# Altium schematic sheet power_supply.SchDoc
size A; PageSetup: Record=PageOptions|CenterHorizontal=True|CenterVertical=True|PrintScale=1.00|XCorrection=1.00|YCorrection=1.00|PrintKind=1|BorderSize=5000000|LeftOffset=0|BottomOffset=0|Orientation=2|PaperLength=1000|PaperWidth=1000|Scale=100|PaperSource=7|PrintQuality=-4|MediaType=1|DitherType=10|PaperKind=A4|PrintScaleMode=1
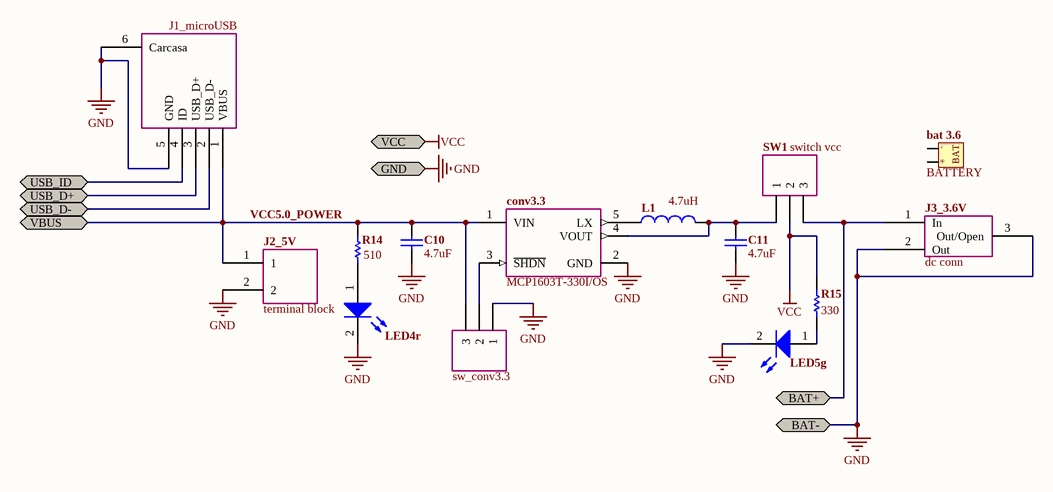
[diagram p0: power_supply.SchDoc]

## Parts
bat_3.6  BATTERY  [BATTERY HOLDER 3 cells]
C10  value 4.7uF  [1608[0603]]  (hidden comment: Cap)
C11  value 4.7uF  [1608[0603]]  (hidden comment: Cap)
conv3.3  MCP1603T-330I/OS  [TSOT-OS5_N]
J1_microUSB  J1_microUSB  [microUSB AB]
J2_5V  terminal block  [Conector ED-1631]
J3_3.6V  dc conn  [DC Connector]
L1  value 4.7uH  [CD3225-1210]  (hidden comment: L)
LED4r  LED_SMD_Hg  [1608[0603]]  (value not drawn)
LED5g  LED_SMD_Hg  [1608[0603]]  (value not drawn)
R14  value 510  [1608[0603]]  (hidden comment: Res1)
R15  value 330  [1608[0603]]  (hidden comment: R)
SW1  switch vcc  [SWITCH-2]
SW2  sw_conv3.3  [HDR1X3]

## Ports
BAT+, BAT-, GND, USB_D+, USB_D-, USB_ID, VBUS, VCC

## Nets
GND: C10.1 C11.1 conv3.3.2(GND) J1_microUSB.5(GND) J1_microUSB.6(Carcasa) J2_5V.2 J3_3.6V.2(Out) J3_3.6V.3(Out/Open) LED4r.2(K) LED5g.2(K) SW2.1 ; port BAT-, port GND
VCC: R15.2 SW1.2 ; port VCC
BAT+: J3_3.6V.1(In) SW1.3 ; port BAT+
USB_D+: J1_microUSB.3(USB_D+) ; port USB_D+
USB_D-: J1_microUSB.2(USB_D-) ; port USB_D-
USB_ID: J1_microUSB.4(ID) ; port USB_ID
VCC5.0_POWER: C10.2 conv3.3.1(VIN) J1_microUSB.1(VBUS) J2_5V.1 R14.1 SW2.3 ; port VBUS
NetC11_2: C11.2 conv3.3.4(VOUT) L1.2 SW1.1
Netconv3.3_3: conv3.3.3(~{SHDN}) SW2.2
Netconv3.3_5: conv3.3.5(LX) L1.1
NetLED4r_1: LED4r.1(A) R14.2
NetLED5g_1: LED5g.1(A) R15.1

## Notes on the sheet
- (in symbol BATTERY) -; +; BAT

## Library data of the parts
C10 C11 = Cap: Capacitor; Published: 8-Jun-2000; LatestRevisionDate: 17-Jul-2002; LatestRevisionNote: Re-released for DXP Platform.; PackageReference: RAD-0.3; Publisher: Altium Limited; PackageDescription: Radial Cap, Thru-Hole; 2 Leads; 0.3 in Pin Spacing
conv3.3 = MCP1603T-330I/OS: 500mA Synchronous Buck Regulator, 3.3V, 2.0 MHz, 5-Pin TSOT, Industrial Temperature, Tape and Reel; Published: 29-Jan-2009; DatasheetVersion: revA, May-2007; PackageVersion: revAW, Oct-2008; PackageReference: TSOT-OS5; Publisher: Altium Limited; PackageDescription: 5-Lead Plastic Small Outline Transistor (OS) [TSOT]; ComponentLink1Description: Manufacturer Link; ComponentLink1URL: http://www.microchip.com; ComponentLink2Description: Datasheet; ComponentLink2URL: http://ww1.microchip.com/downloads/en/DeviceDoc/22042a.pdf; ComponentLink3Description: Packaging Specification; ComponentLink3URL: http://ww1.microchip.com/downloads/en/PackagingSpec/00049AW.pdf
J1_microUSB = USB micro AB: buy: farnell:1568022
J2_5V = Conector ED-1631: Terminal Block 2 vías, 5mm
J3_3.6V = DC Connector: buy: farnell:
L1 = L: Inductor; Manufacturer: Generic Components; Class: Passive; buy: farnell:1717469; Published: 08/06/2000; Publisher: Altium Hobart Technology Centre; SubClass: Inductor
LED4r LED5g = LED_SMD_Hg: Typical BLUE SiC LED; Manufacturer: Generic Components; Class: Optoelectronic; Published: 08/06/2000; Publisher: Altium Hobart Technology Centre; SubClass: LED
R14 = Res1: Resistor; Published: 8-Jun-2000; LatestRevisionDate: 17-Jul-2002; LatestRevisionNote: Re-released for DXP Platform.; PackageReference: AXIAL-0.3; Publisher: Altium Limited; PackageDescription: Axial Device, Thru-Hole; 2 Leads; 0.3 in Pin Spacing
R15 = R: Resistor; Manufacturer: Generic Components; Class: Passive; Published: 08/06/2000; Publisher: Altium Hobart Technology Centre; SubClass: Resistor
SW1 SW2 = SWITCH-2: Header, 3-Pin; LatestRevisionDate: 17-Jul-2002; LatestRevisionNote: Re-released for DXP Platform.; Publisher: Altium Limited